# EasyEDA schematic EasyEDA_SCH_5.5-OLED-to-RP5-MIPI.json
TITLE: Sheet_V2; REV: 2.0; Date: 2025-08-22; Sheet: 1/1; Drawn By: Hjalte Hansen
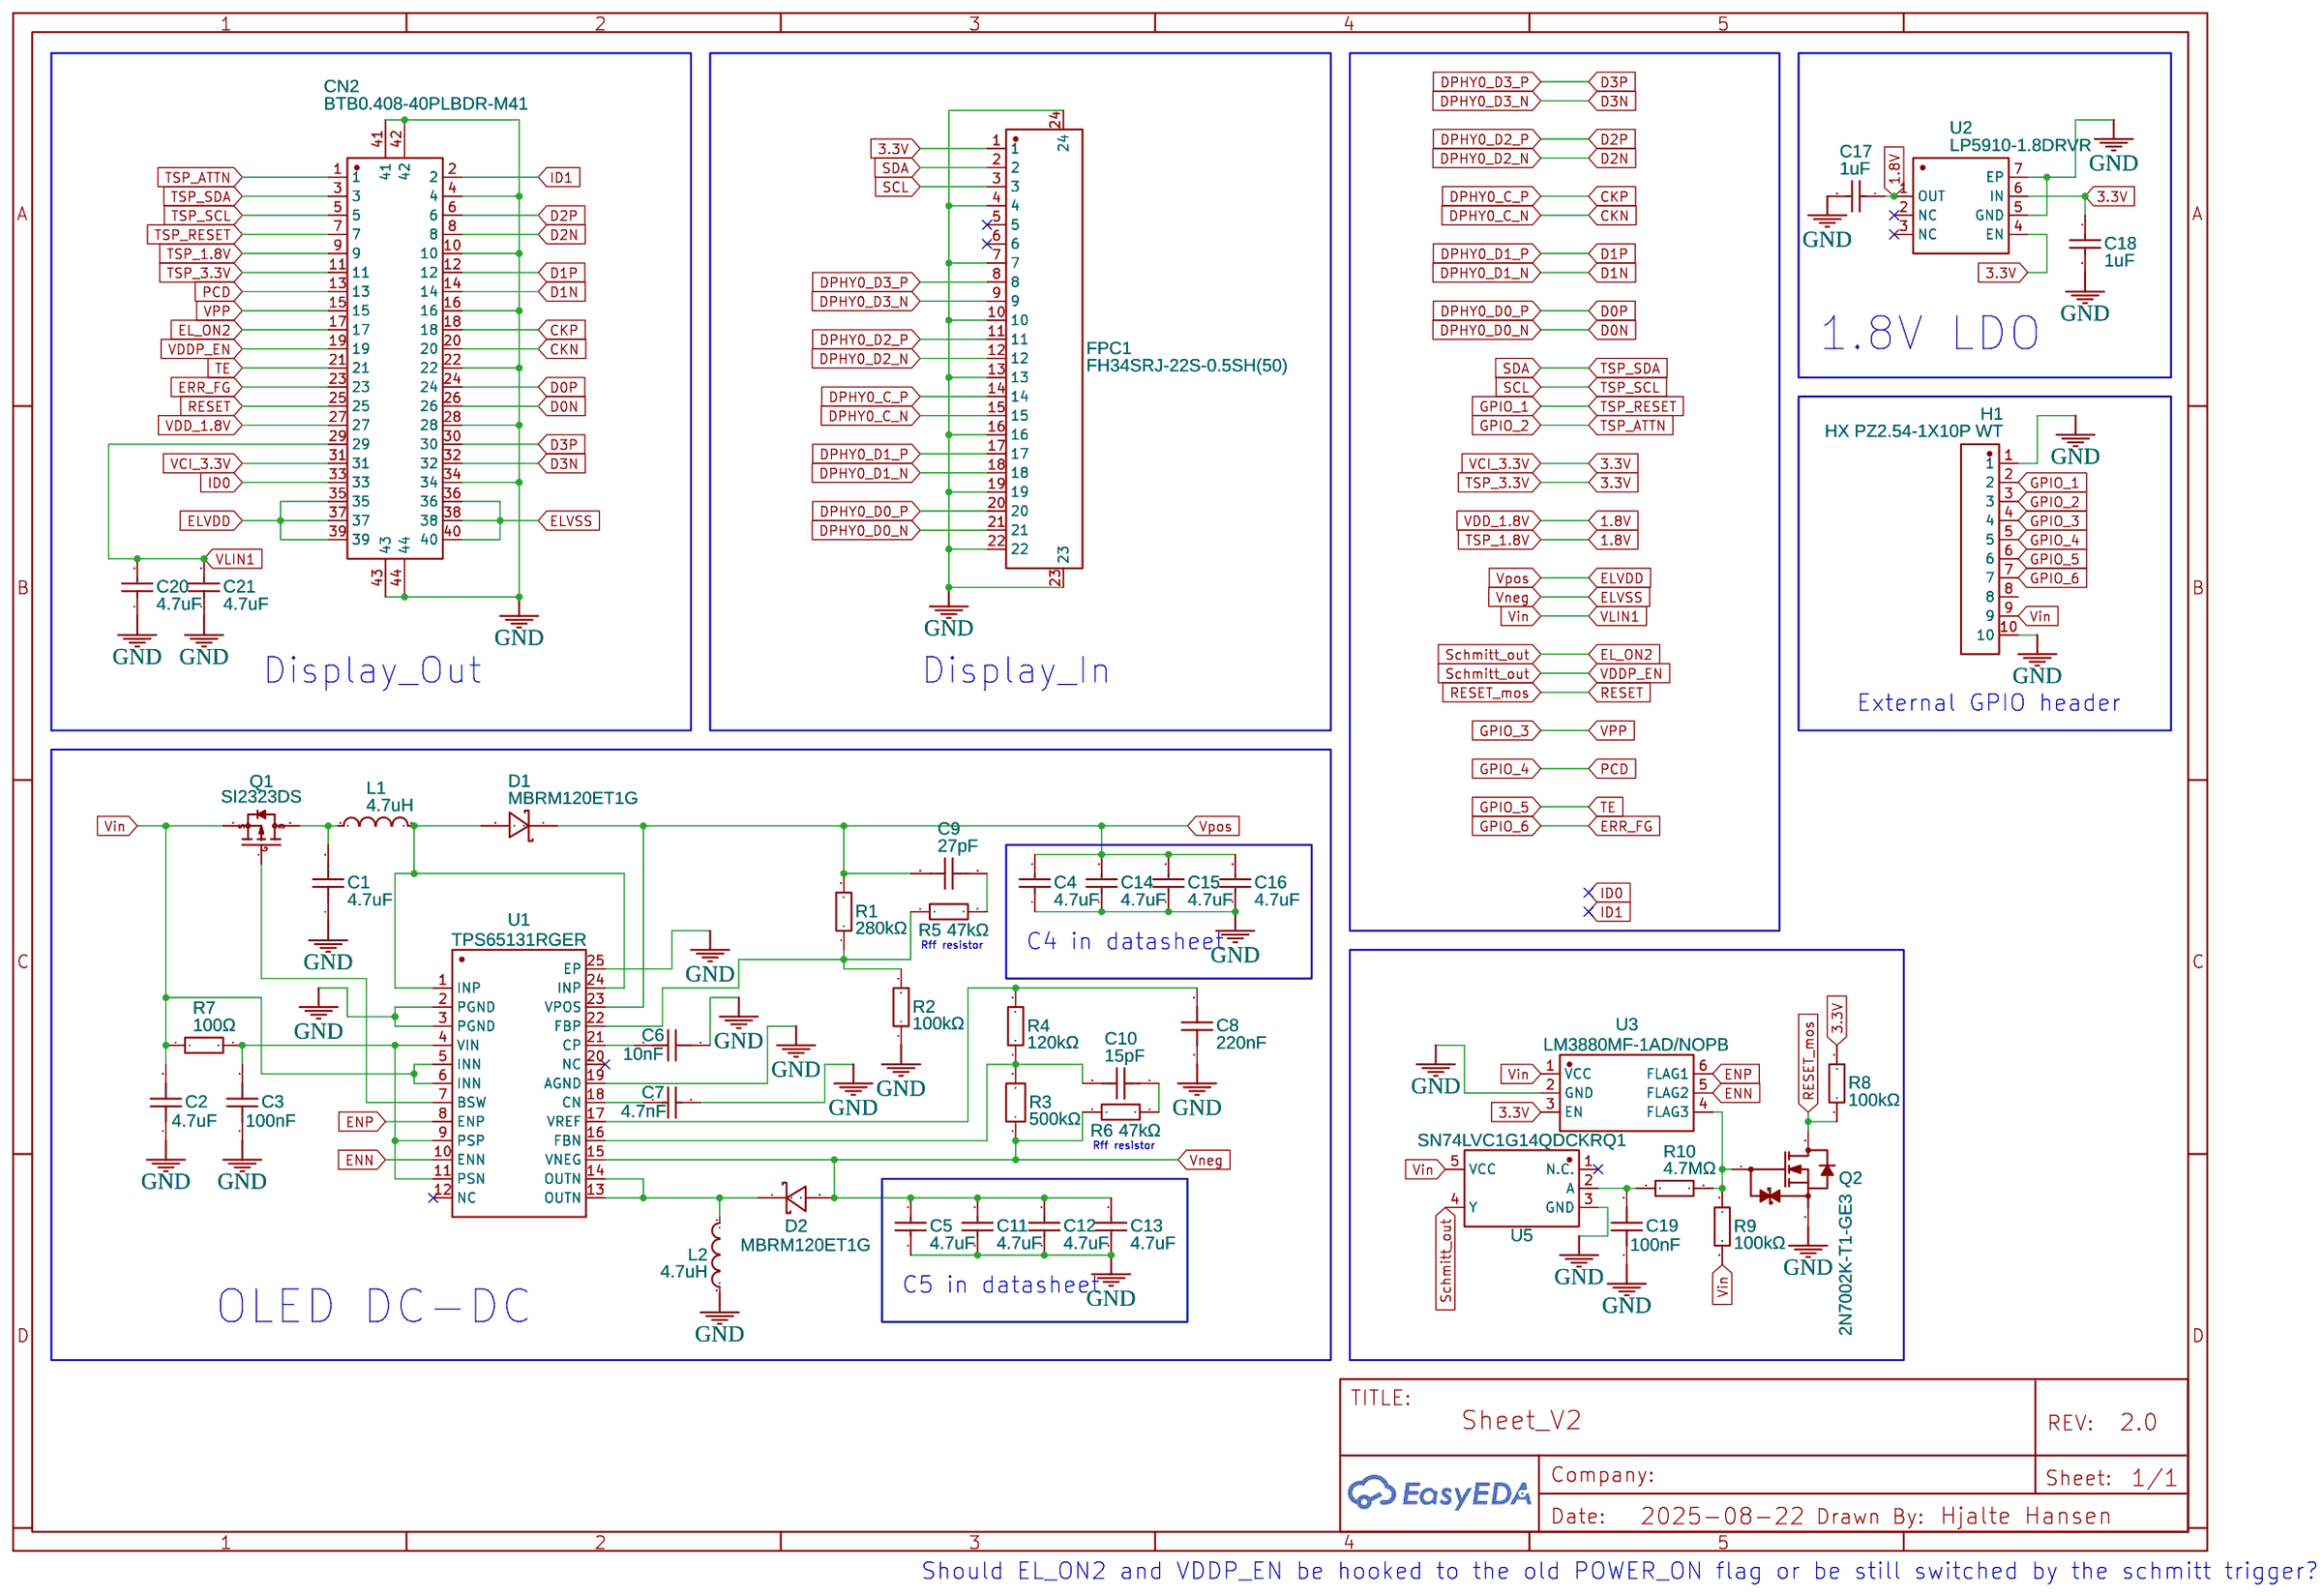
[diagram p0: schematic sheet]

## Parts
C1  4.7uF  [C0402]
C2  4.7uF  [C0402]
C3  100nF  [C0402]
C4  4.7uF  [C0805]
C5  4.7uF  [C0805]
C6  10nF  [C0402]
C7  4.7nF  [C0603]
C8  220nF  [C0402]
C9  27pF  [C0603]
C10  15pF  [C0402]
C11  4.7uF  [C0805]
C12  4.7uF  [C0805]
C13  4.7uF  [C0805]
C14  4.7uF  [C0805]
C15  4.7uF  [C0805]
C16  4.7uF  [C0805]
C17  1uF  [C0603]
C18  1uF  [C0603]
C19  100nF  [C0402]
C20  4.7uF  [C0805]
C21  4.7uF  [C0805]
CN2  BTB0.408-40PLBDR-M41  [CONN-SMD_40P-BTB0.408-40PLBDR-M41]
D1  MBRM120ET1G  [POWERMITE_L2.0-W1.9-LS3.8-RD]
D2  MBRM120ET1G  [POWERMITE_L2.0-W1.9-LS3.8-RD]
FPC1  FH34SRJ-22S-0.5SH(50)  [FFC-SMD_22P-P0.50_HRS_FH34SRJ-22S-0.5SH]
H1  HX PZ2.54-1X10P WT  [HDR-SMD_10P-P2.54-H-M-W13.3-N]
L1  4.7uH  [IND-SMD_L4.0-W4.0_FNR40XXS]
L2  4.7uH  [IND-SMD_L4.0-W4.0_FNR40XXS]
Q1  SI2323DS  [SOT-23-3_L2.9-W1.3-P1.90-LS2.4-BR]
Q2  2N7002K-T1-GE3  [SOT-23-3_L2.9-W1.6-P1.90-LS2.8-BR]
R1  280kΩ  [R0603]
R2  100kΩ  [R0603]
R3  500kΩ  [R0603]
R4  120kΩ  [R0603]
R5  47kΩ  [R0603]
R6  47kΩ  [R0603]
R7  100Ω  [R0402]
R8  100kΩ  [R0603]
R9  100kΩ  [R0603]
R10  4.7MΩ  [R0603]
U1  TPS65131RGER  [QFN-24_L4.0-W4.0-P0.50-TL-EP2.6]
U2  LP5910-1.8DRVR  [WSON-6_L2.0-W2.0-P0.65-TL-EP]
U3  LM3880MF-1AD/NOPB  [SOT-23-6_L2.9-W1.6-P0.95-LS2.8-BL]
U5  SN74LVC1G14QDCKRQ1  [SC-70-5_L2.1-W1.3-P0.65-LS2.1-BR]

## Library data of the parts
C1 C2 = CL05A475MQ5NRNC_C307423: Contributor: LCSC; Supplier: LCSC; Supplier Part: C307423; Manufacturer: SAMSUNG(三星); Manufacturer Part: CL05A475MQ5NRNC; JLCPCB Part Class: Extended Part; Package Display: No
C3 C19 = CL05B104KP5NNNC: Contributor: LCSC; Supplier: LCSC; Supplier Part: C133086; Manufacturer: SAMSUNG(三星); JLCPCB Part Class: Extended Part; Package Display: No
C4 C5 C11-C13 C20 = CL21A475KAQNNNE: Supplier: LCSC; Manufacturer: SAMSUNG(三星); Supplier Part: C1779; JLCPCB Part Class: Basic Part
C6 = CL05B103KO5NNNC: Contributor: LCSC; Supplier: LCSC; Supplier Part: C318577; Manufacturer: SAMSUNG(三星); JLCPCB Part Class: Extended Part; Package Display: No
C7 = CL10B472KB8NNNC: Supplier: LCSC; Manufacturer: SAMSUNG(三星); Supplier Part: C1621; JLCPCB Part Class: Extended Part; Package Display: No
C8 = CL05A224KQ5NNNC: Contributor: LCSC; Supplier: LCSC; Supplier Part: C307417; Manufacturer: SAMSUNG(三星); JLCPCB Part Class: Extended Part; Package Display: No
C9 = CC0603JRNPO7BN270: Supplier: LCSC; Supplier Part: C2187529; Manufacturer: YAGEO(国巨); JLCPCB Part Class: Extended Part; Contributor: lcsc; Package Display: No
C10 = CC0402KRNPO7BN150: Supplier: LCSC; Supplier Part: C1852854; Manufacturer: YAGEO(国巨); JLCPCB Part Class: Extended Part; Contributor: lcsc; Package Display: No
C14-C16 C21 = CL21A475KAQNNNE: Supplier: LCSC; Manufacturer: SAMSUNG(三星); Supplier Part: C1779; JLCPCB Part Class: Basic Part; Package Display: No
C17 C18 = CL10A105KO8NNNC: Supplier: LCSC; Manufacturer: SAMSUNG(三星); Supplier Part: C1592; JLCPCB Part Class: Extended Part
CN2 = BTB0.408-40PLBDR-M41: Supplier: LCSC; Supplier Part: C42420583; Manufacturer: XUNPU(讯普); Contributor: lcsc
D1 D2 = MBRM120ET1G: Contributor: LCSC; Supplier Part: C152484; Supplier: LCSC; Manufacturer: onsemi(安森美); JLCPCB Part Class: Extended Part
FPC1 = FH34SRJ-22S-0.5SH(50): Contributor: LCSC; Supplier: LCSC; Supplier Part: C2889325; Manufacturer: HRS(广濑); JLCPCB Part Class: Extended Part
H1 = HX PZ2.54-1X10P WT: Supplier: LCSC; Supplier Part: C46061683; Manufacturer: hanxia(韩下); Manufacturer Part: HX PZ2.54-1x10P WT; JLCPCB Part Class: Extended Part; Contributor: lcsc
L1 L2 = FNR4020S4R7MT: Contributor: LCSC; Supplier: LCSC; Manufacturer: cjiang(长江微电); Supplier Part: C167828; JLCPCB Part Class: Extended Part
Q1 = SI2323DS: Contributor: lcsc; Supplier: LCSC; Supplier Part: C5182044; Manufacturer: TECH PUBLIC(台舟); JLCPCB Part Class: Extended Part
Q2 = 2N7002K-T1-GE3: Supplier: LCSC; Manufacturer: VISHAY(威世); Supplier Part: C81445; JLCPCB Part Class: Extended Part
R1 = 0603WAF2803T5E: Supplier: LCSC; Manufacturer: UNI-ROYAL(厚声); Supplier Part: C22970; JLCPCB Part Class: Extended Part
R2 = 0603WAF1003T5E: Supplier: LCSC; Manufacturer: UNI-ROYAL(厚声); Supplier Part: C25803; JLCPCB Part Class: Basic Part
R3 = AR03BTCX5003N: Contributor: LCSC; Supplier: LCSC; Supplier Part: C2902631; Manufacturer: Viking(光颉); JLCPCB Part Class: Extended Part
R4 = 0603WAF1203T5E: Supplier: LCSC; Manufacturer: UNI-ROYAL(厚声); Supplier Part: C25808; JLCPCB Part Class: Basic Part
R5 R6 = RC0603FR-0747KL: Supplier: LCSC; Manufacturer: YAGEO(国巨); Supplier Part: C105579; JLCPCB Part Class: Extended Part
R7 = RC0402FR-07100RL: Supplier: LCSC; Manufacturer: YAGEO(国巨); Supplier Part: C106232; JLCPCB Part Class: Extended Part; Package Display: No
R8 R9 = RC0603FR-07100KL: Contributor: LCSC; Supplier: LCSC; Supplier Part: C14675; Manufacturer: YAGEO(国巨); JLCPCB Part Class: Extended Part
R10 = 0603WAF4704T5E: Supplier: LCSC; Manufacturer: UNI-ROYAL(厚声); Supplier Part: C23163; JLCPCB Part Class: Extended Part
U1 = TPS65131RGER: Supplier: LCSC; Manufacturer: TI(德州仪器); Supplier Part: C87663; JLCPCB Part Class: Extended Part
U2 = LP5910-1.8DRVR: Contributor: LCSC; Supplier: LCSC; Supplier Part: C2867568; Manufacturer: TI(德州仪器); JLCPCB Part Class: Extended Part
U3 = LM3880MF-1AD/NOPB: Contributor: LCSC; Supplier: LCSC; Supplier Part: C701868; Manufacturer: TI(德州仪器); JLCPCB Part Class: Extended Part
U5 = SN74LVC1G14QDCKRQ1: Supplier: LCSC; Supplier Part: C2684620; Manufacturer: TI(德州仪器); JLCPCB Part Class: Extended Part; Contributor: lcsc

## Nets
1.8V: C17.1 CN2.9 CN2.27 U2.1(OUT)
3.3V: C18.1 CN2.11 CN2.31 FPC1.1 R8.1 U2.4(EN) U2.6(IN) U3.3(EN)
GND: C1.1 C2.1 C3.1 C4.1 C5.1 C6.2 C7.2 C8.1 C11.1 C12.1 C13.1 C14.1 C15.1 C16.1 C17.2 C18.2 C19.1 C20.1 C21.1 CN2.4 CN2.10 CN2.16 CN2.22 CN2.28 CN2.34 CN2.41 CN2.42 CN2.43 CN2.44 FPC1.4 FPC1.7 FPC1.10 FPC1.13 FPC1.16 FPC1.19 FPC1.22 FPC1.23 FPC1.24 H1.1 H1.10 L2.2 Q2.2(S) R2.1 U1.2(PGND) U1.3(PGND) U1.19(AGND) U1.25(EP) U2.5(GND) U2.7(EP) U3.2(GND) U5.3(GND)
CKN: CN2.20 FPC1.15
CKP: CN2.18 FPC1.14
D0N: CN2.26 FPC1.21
D0P: CN2.24 FPC1.20
D1N: CN2.14 FPC1.18
D1P: CN2.12 FPC1.17
D2N: CN2.8 FPC1.12
D2P: CN2.6 FPC1.11
D3N: CN2.32 FPC1.9
D3P: CN2.30 FPC1.8
EL_ON2: CN2.17 CN2.19 U5.4(Y)
ELVDD: C4.2 C9.2 C14.2 C15.2 C16.2 CN2.35 CN2.37 CN2.39 D1.1(C) R1.2 U1.23(VPOS)
ELVSS: C5.2 C11.2 C12.2 C13.2 CN2.36 CN2.38 CN2.40 D2.2(A) R3.1 R6.1 U1.15(VNEG)
ENN: U1.10(ENN) U3.5(FLAG2)
ENP: U1.8(ENP) U3.6(FLAG1)
ERR_FG: CN2.23 H1.7
GPIO_1: CN2.7 H1.2
GPIO_2: CN2.1 H1.3
GPIO_3: CN2.15 H1.4
GPIO_4: CN2.13 H1.5
GPIO_5: CN2.21 H1.6
ID0: CN2.33
ID1: CN2.2
RESET: CN2.25 Q2.3(D) R8.2
SCL: CN2.5 FPC1.3
SDA: CN2.3 FPC1.2
VLIN1: C2.2 C20.2 C21.2 CN2.29 H1.9 Q1.2(S) R7.1 R9.2 U1.5(INN) U1.6(INN) U3.1(VCC) U5.5(VCC)
Net-(C1-2): C1.2 L1.1 Q1.3(D)
Net-(C3-2): C3.2 R7.2 U1.4(VIN) U1.9(PSP) U1.11(PSN)
Net-(C6-1): C6.1 U1.21(CP)
Net-(C7-1): C7.1 U1.18(CN)
Net-(C8-2): C8.2 R4.2 U1.17(VREF)
Net-(C9-1): C9.1 R5.2
Net-(C10-1): C10.1 R6.2
Net-(C10-2): C10.2 R3.2 R4.1 U1.16(FBN)
Net-(C19-2): C19.2 R10.1 U5.2(A)
Net-(D1-2): D1.2(A) L1.2 U1.1(INP) U1.24(INP)
Net-(D2-1): D2.1(C) L2.1 U1.13(OUTN) U1.14(OUTN)
Net-(Q1-1): Q1.1(G) U1.7(BSW)
Net-(Q2-1): Q2.1(G) R9.1 R10.2 U3.4(FLAG3)
Net-(R1-1): R1.1 R2.2 R5.1 U1.22(FBP)

Not connected (* = marked no-connect by the designer): FPC1 5* 6*; H1 8; U1 12(NC)* 20(NC)*; U2 2(NC)* 3(NC)*; U5 1(N.C.)*

## Notes on the sheet
- 1.8V LDO
- Display_Out
- Display_In
- External GPIO header
- Rff resistor
- C4 in datasheet
- Rff resistor
- C5 in datasheet
- OLED DC-DC
- Should EL_ON2 and VDDP_EN be hooked to the old POWER_ON flag or be still switched by the schmitt trigger?
